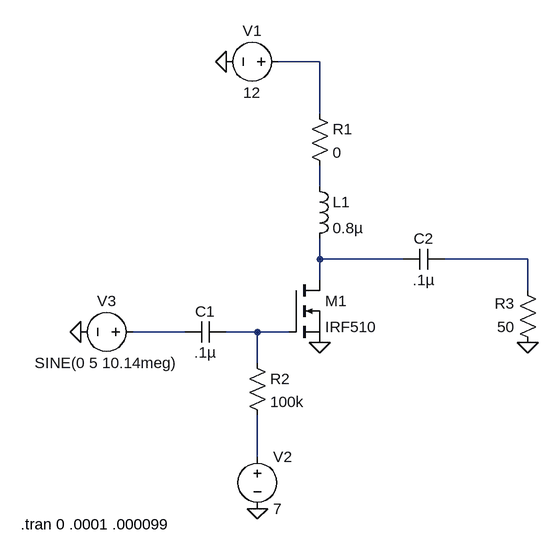
[diagram p0: schematic IRF150-classC.asc]
IRF150-classC.asc, the LTspice schematic file:
Version 4
SHEET 1 880 680
WIRE 208 -224 144 -224
WIRE 208 -144 208 -224
WIRE 208 -32 208 -64
WIRE 208 80 208 48
WIRE 336 80 208 80
WIRE 528 80 400 80
WIRE 208 112 208 80
WIRE 528 128 528 80
WIRE 0 192 -80 192
WIRE 112 192 64 192
WIRE 160 192 112 192
WIRE 112 240 112 192
WIRE 112 384 112 320
FLAG 208 208 0
FLAG 64 -224 0
FLAG 112 464 0
FLAG -160 192 0
FLAG 528 208 0
SYMBOL nmos 160 112 R0
SYMATTR InstName M1
SYMATTR Value IRF510
SYMBOL ind 192 -48 R0
SYMATTR InstName L1
SYMATTR Value 0.8µ
SYMBOL res 192 -160 R0
SYMATTR InstName R1
SYMATTR Value 0
SYMBOL voltage 160 -224 R90
WINDOW 0 -32 56 VBottom 2
WINDOW 3 32 56 VTop 2
WINDOW 123 0 0 Left 0
WINDOW 39 0 0 Left 0
SYMATTR InstName V1
SYMATTR Value 12
SYMBOL cap 64 176 R90
WINDOW 0 0 32 VBottom 2
WINDOW 3 32 32 VTop 2
SYMATTR InstName C1
SYMATTR Value .1µ
SYMBOL res 96 224 R0
SYMATTR InstName R2
SYMATTR Value 100k
SYMBOL voltage 112 368 R0
WINDOW 123 0 0 Left 0
WINDOW 39 0 0 Left 0
SYMATTR InstName V2
SYMATTR Value 7
SYMBOL voltage -64 192 R90
WINDOW 0 -32 56 VBottom 2
WINDOW 3 32 56 VTop 2
WINDOW 123 0 0 Left 0
WINDOW 39 0 0 Left 0
SYMATTR InstName V3
SYMATTR Value SINE(0 5 10.14meg)
SYMBOL res 544 224 R180
WINDOW 0 36 76 Left 2
WINDOW 3 36 40 Left 2
SYMATTR InstName R3
SYMATTR Value 50
SYMBOL cap 400 64 R90
WINDOW 0 0 32 VBottom 2
WINDOW 3 32 32 VTop 2
SYMATTR InstName C2
SYMATTR Value .1µ
TEXT -252 488 Left 2 !.tran 0 .0001 .000099

The netlist it stands for:
* IRF150-classC.asc
M1 N003 N006 0 0 IRF510
L1 N002 N003 0.8µ
R1 N001 N002 0
V1 N001 0 12
C1 N006 N005 .1µ
R2 N006 N007 100k
V2 N007 0 7
V3 N005 0 SINE(0 5 10.14meg)
R3 0 N004 50
C2 N004 N003 .1µ
.model NMOS NMOS
.model PMOS PMOS
.lib standard.mos
.tran 0 .0001 .000099
.backanno
.end